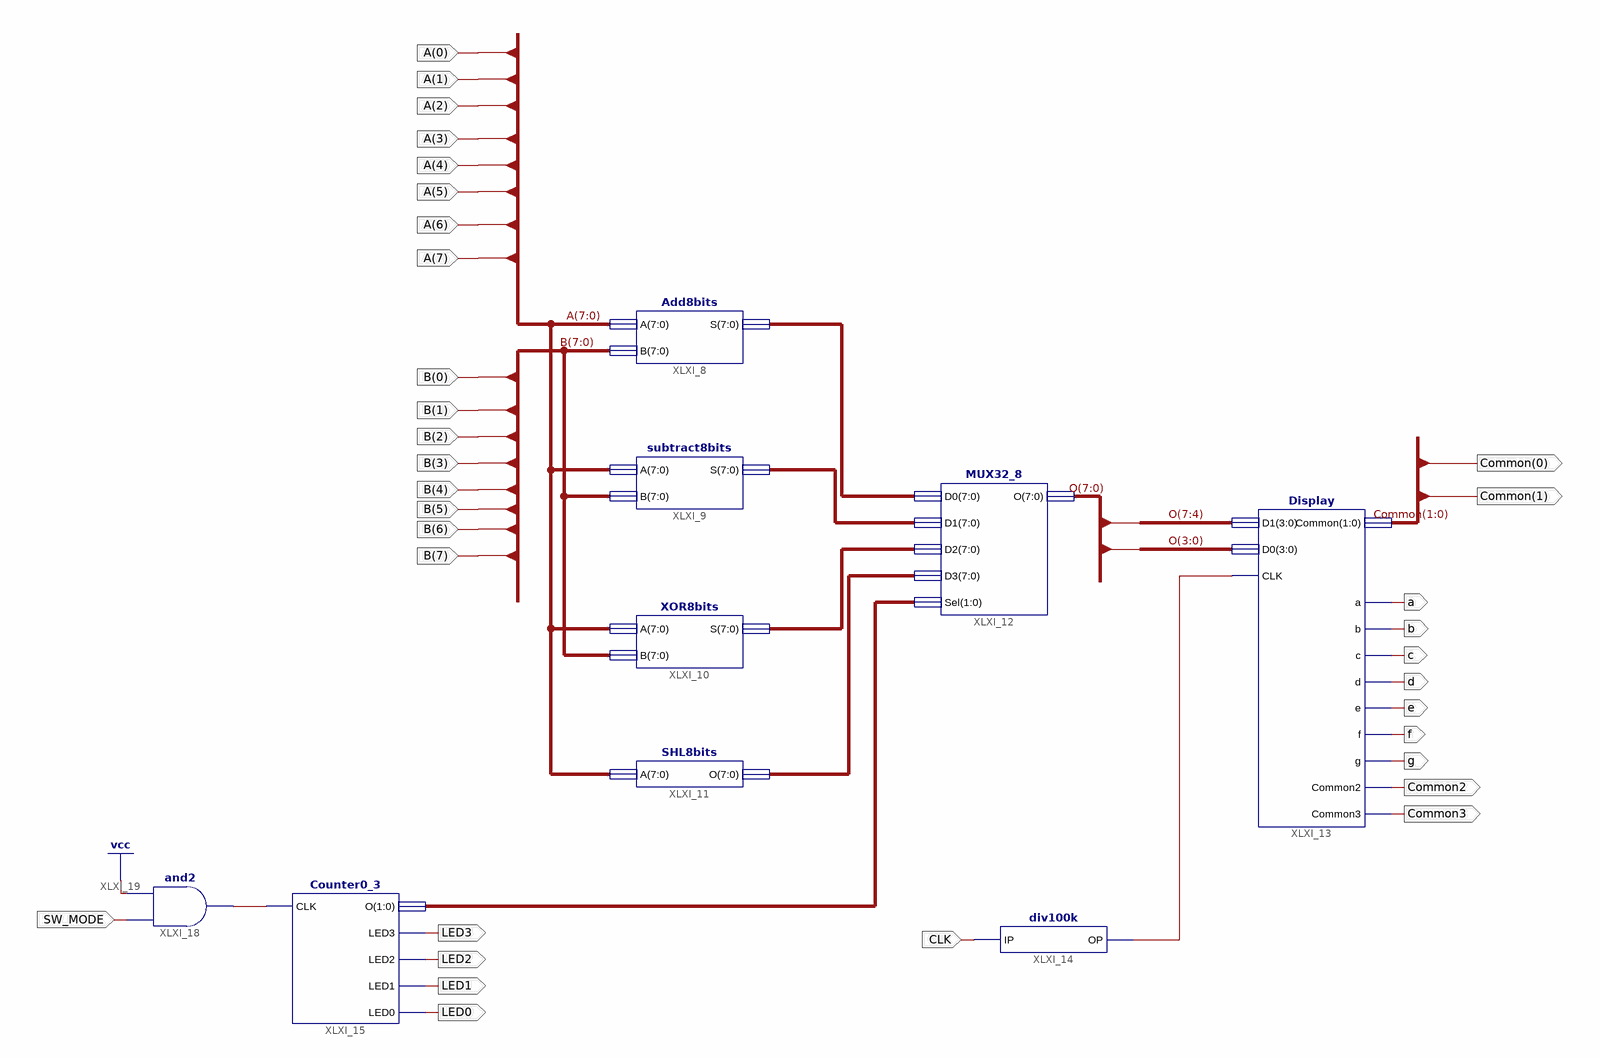
[diagram p0: schematic sheet 1]
// Xilinx ISE schematic Lab9.sch (spartan6) as structural Verilog: 9 symbols, 33 ports
module Lab9 (
  input  CLK,
  input  SW_MODE,
  input  [7:0] a,
  input  [7:0] b,
  output [1:0] Common,
  output a_1bit,
  output b_1bit,
  output c,
  output d,
  output e,
  output f,
  output g,
  output Common2,
  output Common3,
  output LED3,
  output LED2,
  output LED1,
  output LED0
);

  wire XLXN_20, XLXN_40;
  wire [1:0] XLXN_42;
  wire [7:0] O, XLXN_15, XLXN_16, XLXN_17, XLXN_18;

  Add8bits XLXI_8 (.A(a), .B(b), .S(XLXN_15));
  subtract8bits XLXI_9 (.A(a), .B(b), .S(XLXN_16));
  XOR8bits XLXI_10 (.A(a), .B(b), .S(XLXN_17));
  SHL8bits XLXI_11 (.A(a), .O(XLXN_18));
  MUX32_8 XLXI_12 (.D0(XLXN_15), .D1(XLXN_16), .D2(XLXN_17), .D3(XLXN_18), .Sel(XLXN_42), .O(O));
  Counter0_3 XLXI_15 (.CLK(XLXN_40), .O(XLXN_42), .LED3(LED3), .LED2(LED2), .LED1(LED1), .LED0(LED0));
  Display XLXI_13 (
    .D1(O[7:4]), .D0(O[3:0]), .CLK(XLXN_20), .Common(Common), .a(a_1bit), .b(b_1bit), .c(c), .d(d), .e(e),
    .f(f), .g(g), .Common2(Common2), .Common3(Common3));
  div100k XLXI_14 (.IP(CLK), .OP(XLXN_20));
  and XLXI_18 (XLXN_40, SW_MODE, 1'b1);
endmodule
